# Altium schematic sheet 40. CSI2 CAMERA CONNECTOR.SchDoc: CSI2 EXPANSION CONNECTOR
size 513 x 386 mm; Project: PROC154E2(001)_SK_AM69; Issue: 1.0; RevCode: E3; Page Create Date: March  8, 1995; Variant Name: Core Design; Schematic Page Number: 40; Page Number: 40; Page Size: C; Comment: MISTRAL_TITLEBLK_CSIZE_1; Page Count: 62; Schematic Page Count: 62; Name: PROC154E2 001 SK AM69; DsnPath: C:\Users\danie\Downloads\sprr466c\PROC154E3_RP\PROC154E3_SCH.DSN; SchematicName: SCHEMATIC1; PageName: 40. CSI2 CAMERA CONNECTOR; PageSize: C; TopSchematic: True
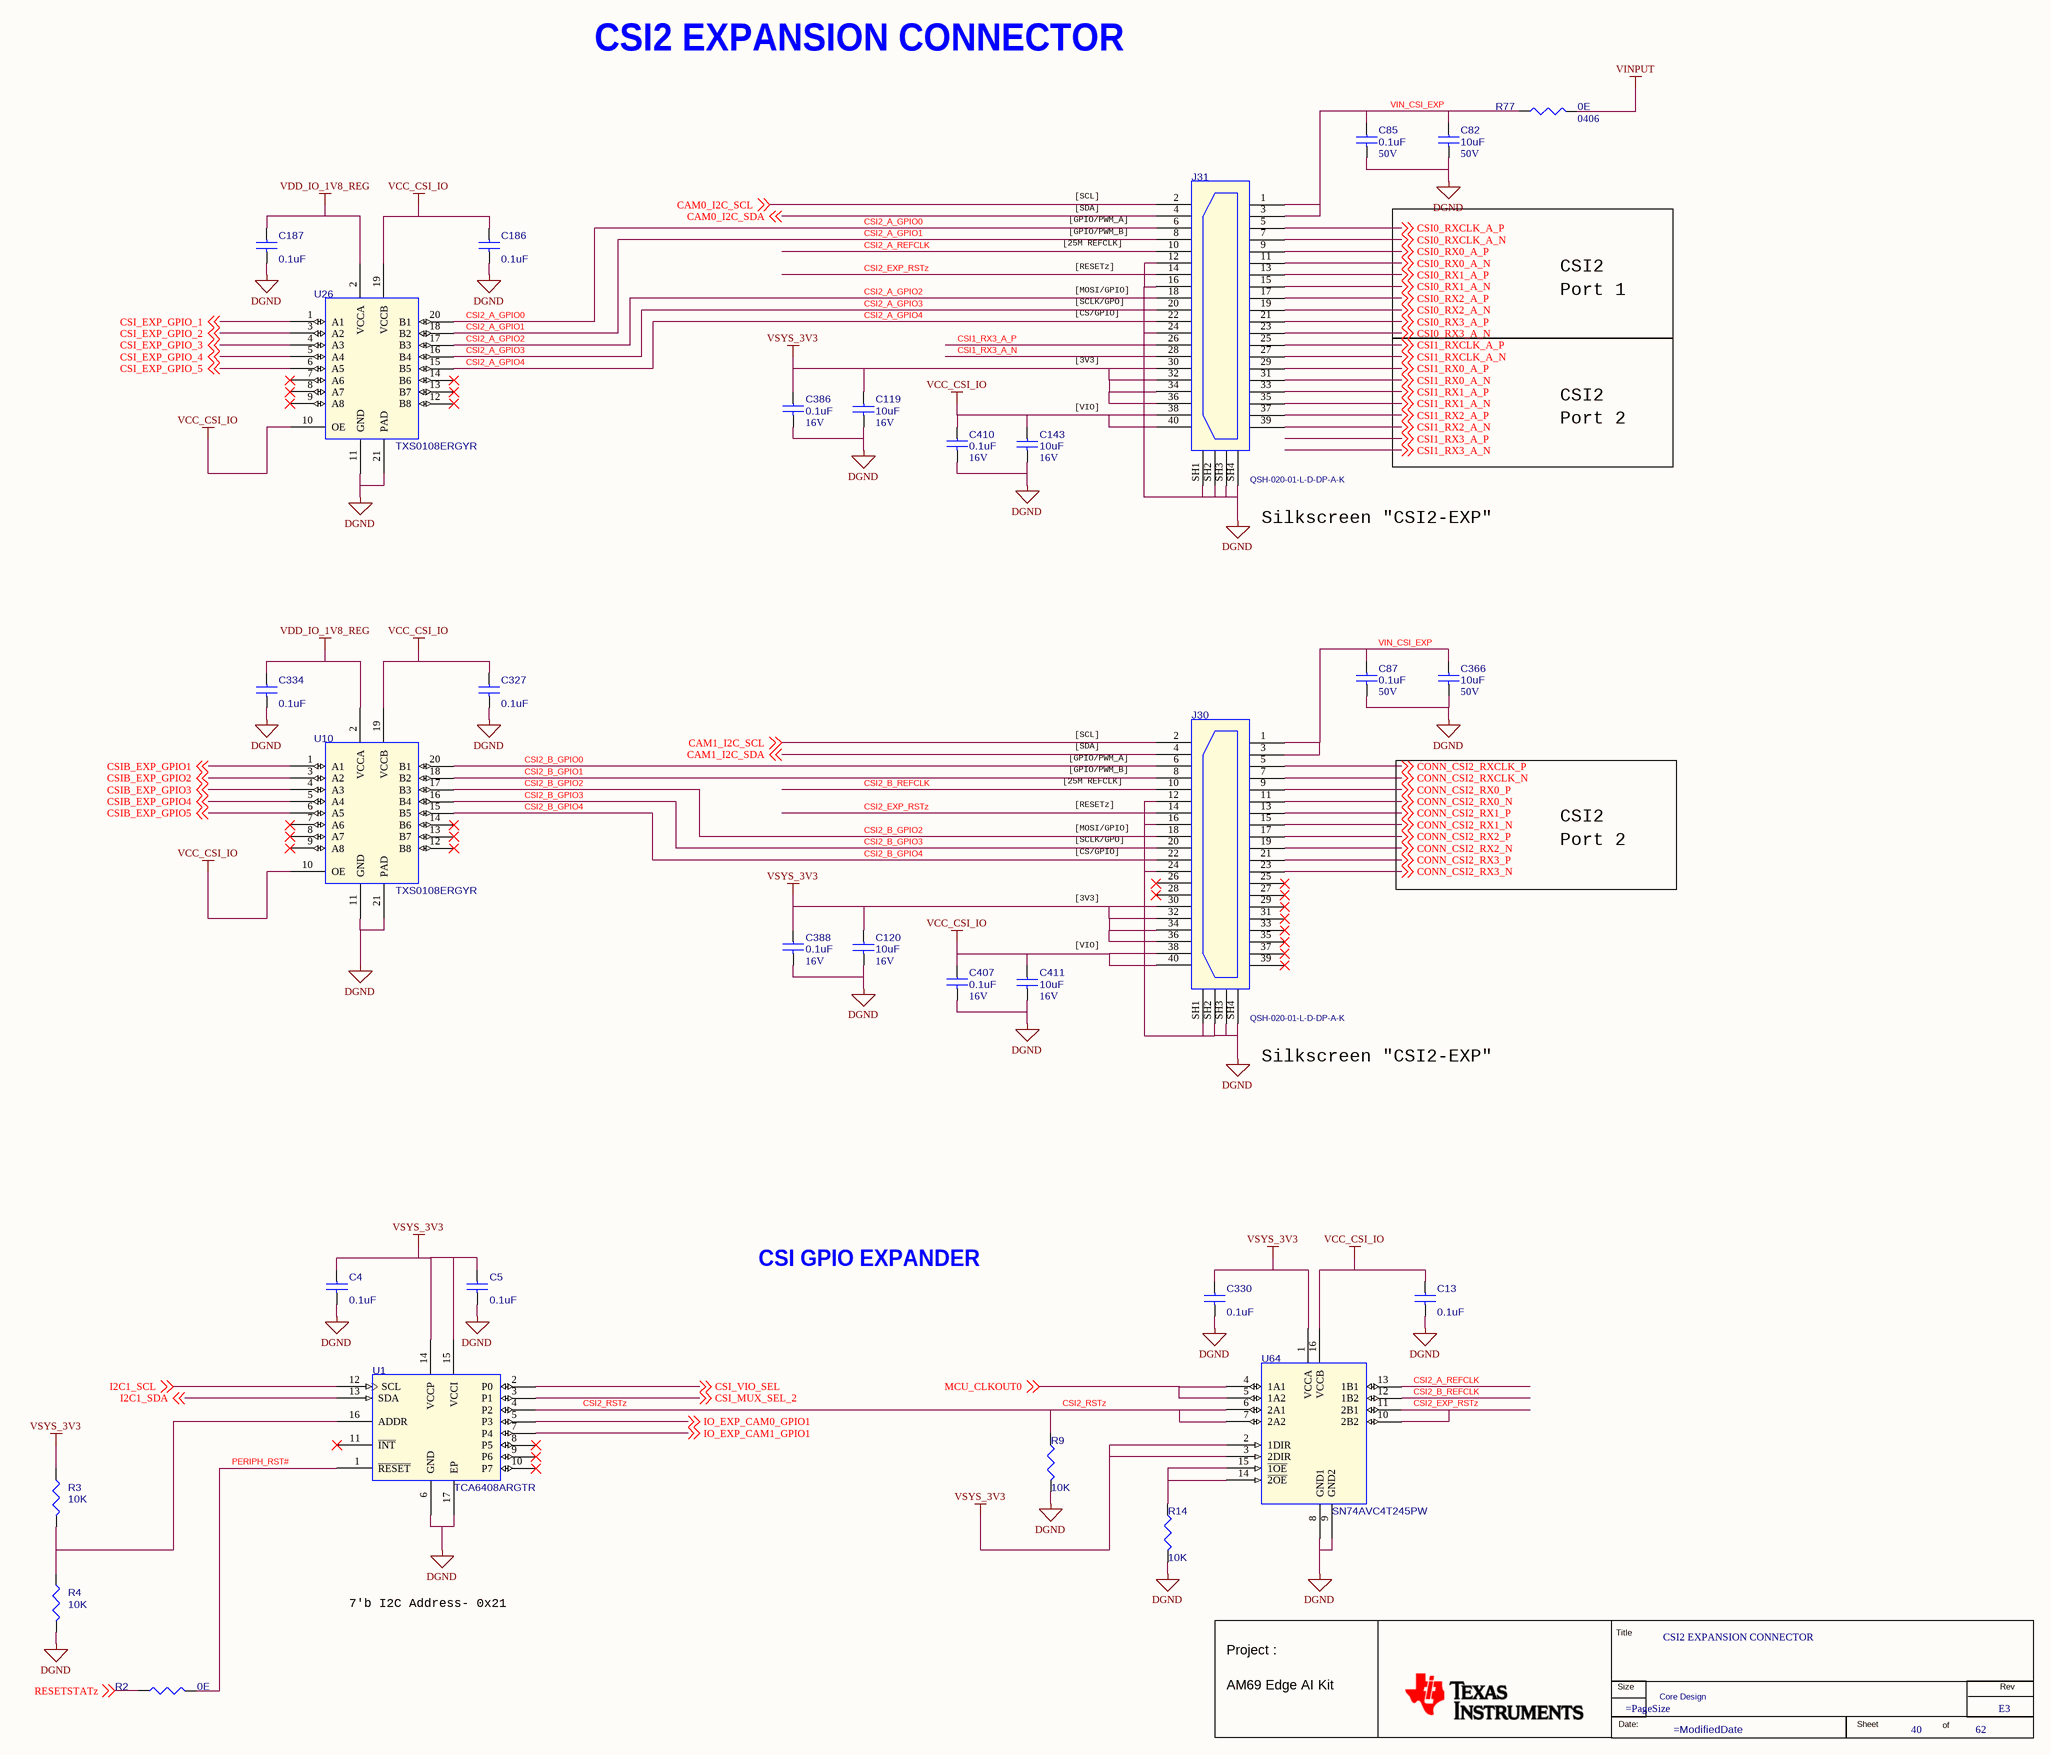
[diagram p0: 40. CSI2 CAMERA CONNECTOR.SchDoc]

## Parts
*  RevCode: E3  Title: CSI2 EXPANSION CONNECTOR  Page Number: 40  Page Count: 62  Variant Name: Core Design  (hidden comment: MISTRAL_TITLEBLK_CSIZE_1)  (graphical)
C4  0.1uF  [CAP0201_0-5]
C5  0.1uF  [CAP0201_0-5]
C13  0.1uF  [CAP0201_0-5]
C82  10uF  Voltage: 50V  [CAP1206_2]
C85  0.1uF  Voltage: 50V  [CAP0402_0-75]
C87  0.1uF  Voltage: 50V  [CAP0402_0-75]
C119  10uF  Voltage: 16V  [CAP0603_1]
C120  10uF  Voltage: 16V  [CAP0603_1]
C143  10uF  Voltage: 16V  [CAP0603_1]
C186  0.1uF  [CAP0201_0-5]
C187  0.1uF  [CAP0201_0-5]
C327  0.1uF  [CAP0201_0-5]
C330  0.1uF  [CAP0201_0-5]
C334  0.1uF  [CAP0201_0-5]
C366  10uF  Voltage: 50V  [CAP1206_2]
C386  0.1uF  Voltage: 16V  [CAP0402_0-75]
C388  0.1uF  Voltage: 16V  [CAP0402_0-75]
C407  0.1uF  Voltage: 16V  [CAP0402_0-75]
C410  0.1uF  Voltage: 16V  [CAP0402_0-75]
C411  10uF  Voltage: 16V  [CAP0603_1]
J30  Mfr_part_number: QSH-020-01-L-D-DP-A-K  [CON_PMC2X20_QSH-020-01-D-DP-A_S_S_S_3-4]  (hidden comment: CON_PMC_2X20_F)
J31  Mfr_part_number: QSH-020-01-L-D-DP-A-K  [CON_PMC2X20_QSH-020-01-D-DP-A_S_S_S_3-4]  (hidden comment: CON_PMC_2X20_F)
R2  0E  [RES0201_0-5]
R3  10K  [RES0201_0-5]
R4  10K  [RES0201_0-5]
R9  10K  [RES0201_0-5]
R14  10K  [RES0201_0-5]
R77  0E  Package: 0406  [RES0406_0-5]
U1  TCA6408ARGTR  [QFN16_19-68_120X120_1_EP1-6]
U10  TXS0108ERGYR  [QFN20_19-68_185X145_1]
U26  TXS0108ERGYR  [QFN20_19-68_185X145_1]
U64  SN74AVC4T245PW  [TSSOP16_25-59_205X180]

## Nets
DGND: C4.2 C5.2 C13.2 C82.2 C85.2 C87.2 C119.2 C120.2 C143.2 C186.2 C187.2 C327.2 C330.2 C334.2 C366.2 C386.2 C388.2 C407.2 C410.2 C411.2 J30.12 J30.16 J30.24 J30.SH1 J30.SH2 J30.SH3 J30.SH4 J31.12 J31.16 J31.24 J31.SH1 J31.SH2 J31.SH3 J31.SH4 R4.1 R9.2 R14.2 U1.6(GND) U1.17(EP) U10.11(GND) U10.21(PAD) U26.11(GND) U26.21(PAD) U64.8(GND1) U64.9(GND2)
VCC_CSI_IO: C13.1 C143.1 C186.1 C327.1 C407.1 C410.1 C411.1 J30.38 J30.40 J31.38 J31.40 U10.10(OE) U10.19(VCCB) U26.10(OE) U26.19(VCCB) U64.16(VCCB)
VDD_IO_1V8_REG: C187.1 C334.1 U10.2(VCCA) U26.2(VCCA)
VINPUT: R77.2
VSYS_3V3: C4.1 C5.1 C119.1 C120.1 C330.1 C386.1 C388.1 J30.30 J30.32 J30.34 J30.36 J31.30 J31.32 J31.34 J31.36 R3.2 U1.14(VCCP) U1.15(VCCI) U64.1(VCCA) U64.2(1DIR) U64.3(2DIR)
CAM0_I2C_SCL: J31.2 ; off-sheet CAM0_I2C_SCL
CAM0_I2C_SDA: J31.4 ; off-sheet CAM0_I2C_SDA
CAM1_I2C_SCL: J30.2 ; off-sheet CAM1_I2C_SCL
CAM1_I2C_SDA: J30.4 ; off-sheet CAM1_I2C_SDA
CONN_CSI2_RX0_N: J30.11 ; off-sheet CONN_CSI2_RX0_N
CONN_CSI2_RX0_P: J30.9 ; off-sheet CONN_CSI2_RX0_P
CONN_CSI2_RX1_N: J30.15 ; off-sheet CONN_CSI2_RX1_N
CONN_CSI2_RX1_P: J30.13 ; off-sheet CONN_CSI2_RX1_P
CONN_CSI2_RX2_N: J30.19 ; off-sheet CONN_CSI2_RX2_N
CONN_CSI2_RX2_P: J30.17 ; off-sheet CONN_CSI2_RX2_P
CONN_CSI2_RX3_N: J30.23 ; off-sheet CONN_CSI2_RX3_N
CONN_CSI2_RX3_P: J30.21 ; off-sheet CONN_CSI2_RX3_P
CONN_CSI2_RXCLK_N: J30.7 ; off-sheet CONN_CSI2_RXCLK_N
CONN_CSI2_RXCLK_P: J30.5 ; off-sheet CONN_CSI2_RXCLK_P
CSI0_RX0_A_N: J31.11 ; off-sheet CSI0_RX0_A_N
CSI0_RX0_A_P: J31.9 ; off-sheet CSI0_RX0_A_P
CSI0_RX1_A_N: J31.15 ; off-sheet CSI0_RX1_A_N
CSI0_RX1_A_P: J31.13 ; off-sheet CSI0_RX1_A_P
CSI0_RX2_A_N: J31.19 ; off-sheet CSI0_RX2_A_N
CSI0_RX2_A_P: J31.17 ; off-sheet CSI0_RX2_A_P
CSI0_RX3_A_N: J31.23 ; off-sheet CSI0_RX3_A_N
CSI0_RX3_A_P: J31.21 ; off-sheet CSI0_RX3_A_P
CSI0_RXCLK_A_N: J31.7 ; off-sheet CSI0_RXCLK_A_N
CSI0_RXCLK_A_P: J31.5 ; off-sheet CSI0_RXCLK_A_P
CSI1_RX0_A_N: J31.31 ; off-sheet CSI1_RX0_A_N
CSI1_RX0_A_P: J31.29 ; off-sheet CSI1_RX0_A_P
CSI1_RX1_A_N: J31.35 ; off-sheet CSI1_RX1_A_N
CSI1_RX1_A_P: J31.33 ; off-sheet CSI1_RX1_A_P
CSI1_RX2_A_N: J31.39 ; off-sheet CSI1_RX2_A_N
CSI1_RX2_A_P: J31.37 ; off-sheet CSI1_RX2_A_P
CSI1_RX3_A_N: J31.28 ; off-sheet CSI1_RX3_A_N
CSI1_RX3_A_P: J31.26 ; off-sheet CSI1_RX3_A_P
CSI1_RXCLK_A_N: J31.27 ; off-sheet CSI1_RXCLK_A_N
CSI1_RXCLK_A_P: J31.25 ; off-sheet CSI1_RXCLK_A_P
CSI2_A_GPIO0: J31.6 U26.20(B1)
CSI2_A_GPIO1: J31.8 U26.18(B2)
CSI2_A_GPIO2: J31.18 U26.17(B3)
CSI2_A_GPIO3: J31.20 U26.16(B4)
CSI2_A_GPIO4: J31.22 U26.15(B5)
CSI2_A_REFCLK: J31.10 U64.13(1B1)
CSI2_B_GPIO0: J30.6 U10.20(B1)
CSI2_B_GPIO1: J30.8 U10.18(B2)
CSI2_B_GPIO2: J30.18 U10.17(B3)
CSI2_B_GPIO3: J30.20 U10.16(B4)
CSI2_B_GPIO4: J30.22 U10.15(B5)
CSI2_B_REFCLK: J30.10 U64.12(1B2)
CSI2_EXP_RSTz: J30.14 J31.14 U64.10(2B2) U64.11(2B1)
CSI2_RSTz: R9.1 U1.4(P2) U64.6(2A1) U64.7(2A2)
CSI_EXP_GPIO_1: U26.1(A1) ; off-sheet CSI_EXP_GPIO_1
CSI_EXP_GPIO_2: U26.3(A2) ; off-sheet CSI_EXP_GPIO_2
CSI_EXP_GPIO_3: U26.4(A3) ; off-sheet CSI_EXP_GPIO_3
CSI_EXP_GPIO_4: U26.5(A4) ; off-sheet CSI_EXP_GPIO_4
CSI_EXP_GPIO_5: U26.6(A5) ; off-sheet CSI_EXP_GPIO_5
CSI_MUX_SEL_2: U1.3(P1) ; off-sheet CSI_MUX_SEL_2
CSI_VIO_SEL: U1.2(P0) ; off-sheet CSI_VIO_SEL
CSIB_EXP_GPIO1: U10.1(A1) ; off-sheet CSIB_EXP_GPIO1
CSIB_EXP_GPIO2: U10.3(A2) ; off-sheet CSIB_EXP_GPIO2
CSIB_EXP_GPIO3: U10.4(A3) ; off-sheet CSIB_EXP_GPIO3
CSIB_EXP_GPIO4: U10.5(A4) ; off-sheet CSIB_EXP_GPIO4
CSIB_EXP_GPIO5: U10.6(A5) ; off-sheet CSIB_EXP_GPIO5
I2C1_SCL: U1.12(SCL) ; off-sheet I2C1_SCL
I2C1_SDA: U1.13(SDA) ; off-sheet I2C1_SDA
IO_EXP_CAM0_GPIO1: U1.5(P3) ; off-sheet IO_EXP_CAM0_GPIO1
IO_EXP_CAM1_GPIO1: U1.7(P4) ; off-sheet IO_EXP_CAM1_GPIO1
MCU_CLKOUT0: U64.4(1A1) U64.5(1A2) ; off-sheet MCU_CLKOUT0
PERIPH_RST#: R2.2 U1.1(~{RESET})
RESETSTATz: R2.1 ; off-sheet RESETSTATz
VIN_CSI_EXP: C82.1 C85.1 C87.1 C366.1 J30.1 J30.3 J31.1 J31.3 R77.1
NetR3_1: R3.1 R4.2 U1.16(ADDR)
NetR14_1: R14.1 U64.14(~{2OE}) U64.15(~{1OE})

Not connected (* = marked no-connect by the designer): J30 25* 26* 27* 28* 29* 31* 33* 35* 37* 39*; U1 8(P5)* 9(P6)* 10(P7)* 11(~{INT})*; U10 7(A6)* 8(A7)* 9(A8)* 12(B8)* 13(B7)* 14(B6)*; U26 7(A6)* 8(A7)* 9(A8)* 12(B8)* 13(B7)* 14(B6)*

## Notes on the sheet
- CSI2 EXPANSION CONNECTOR
- [25M REFCLK]
- [GPIO/PWM_A]
- [GPIO/PWM_B]
- [SDA]
- [SCL]
- [RESETz]
- [MOSI/GPIO]
- [SCLK/GPO]
- CSI2
- Port 1
- [3V3]
- [CS/GPIO]
- [VIO]
- Port 2
- Silkscreen "CSI2-EXP"
- CSI GPIO EXPANDER
- 7'b I2C Address- 0x21
- (in symbol MISTRAL_TITLEBLK_CSIZE_1) Title; Project :; Size; Rev; AM69 Edge AI Kit; Date:; Sheet; of

## Library data of the parts
* = MISTRAL_TITLEBLK_CSIZE_1: Issue: 1.0; Project: PROC154E2(001)_SK_AM69; Name: PROC154E2 001 SK AM69; Page Create Date: March  8, 1995; Page Size: =PageSize; Page Modify Date: =ModifiedDate; Schematic Page Count: 62; Schematic Page Number: 40
C4 = CAP_Dup1: CAP CERAMIC 0.1uF 16V 10% X7S AUTO 0201; Part Reference: C4; Mistral Part No: 120021030007-R; Mfr_name: MURATA; Mfr_part_number: GRT033C71C104KE01D; Part_type: CAPACITORS\CERAMIC; Project: J7ES_SK_BRD; Wattage: NA; Customs_HS_Code: 85322990; Custom_Duty: 15%; Value: 0.1uF; Tolerance: 10%; Voltage: 16V; Package: 0201; Distributor_name: DIGIKEY; Distributor_part_number: 490-GRT033C71C104KE01DTR-ND; Height: 0.33MM; Weight: 330mg; Temperature: -55°C+125°C; Datasheet: Y:\MIS_DATABASE\DATASHEETS\CAPACITORS\GRT033C71C104KE01.PDF; Crtd /date: ALVY/110321; Chkd/date: MANIRAJA/110321; MECHANICAL 3D STEP FILE: CAP0201_0-5; PCB Footprint: CAP0201_0-5
C5 = CAP_Dup1: CAP CERAMIC 0.1uF 16V 10% X7S AUTO 0201; Part Reference: C5; Mistral Part No: 120021030007-R; Mfr_name: MURATA; Mfr_part_number: GRT033C71C104KE01D; Part_type: CAPACITORS\CERAMIC; Project: J7ES_SK_BRD; Wattage: NA; Customs_HS_Code: 85322990; Custom_Duty: 15%; Value: 0.1uF; Tolerance: 10%; Voltage: 16V; Package: 0201; Distributor_name: DIGIKEY; Distributor_part_number: 490-GRT033C71C104KE01DTR-ND; Height: 0.33MM; Weight: 330mg; Temperature: -55°C+125°C; Datasheet: Y:\MIS_DATABASE\DATASHEETS\CAPACITORS\GRT033C71C104KE01.PDF; Crtd /date: ALVY/110321; Chkd/date: MANIRAJA/110321; MECHANICAL 3D STEP FILE: CAP0201_0-5; PCB Footprint: CAP0201_0-5
C13 = CAP_Dup1: CAP CERAMIC 0.1uF 16V 10% X7S AUTO 0201; Part Reference: C13; Mistral Part No: 120021030007-R; Mfr_name: MURATA; Mfr_part_number: GRT033C71C104KE01D; Part_type: CAPACITORS\CERAMIC; Project: J7ES_SK_BRD; Wattage: NA; Customs_HS_Code: 85322990; Custom_Duty: 15%; Value: 0.1uF; Tolerance: 10%; Voltage: 16V; Package: 0201; Distributor_name: DIGIKEY; Distributor_part_number: 490-GRT033C71C104KE01DTR-ND; Height: 0.33MM; Weight: 330mg; Temperature: -55°C+125°C; Datasheet: Y:\MIS_DATABASE\DATASHEETS\CAPACITORS\GRT033C71C104KE01.PDF; Crtd /date: ALVY/110321; Chkd/date: MANIRAJA/110321; MECHANICAL 3D STEP FILE: CAP0201_0-5; PCB Footprint: CAP0201_0-5
C82 = CAP_Dup1: CAP CERAMIC 10uF 50V 10% X5R AUTO 1206; Part Reference: C82; Mistral Part No: 120011060019-R; Mfr_name: MURATA; Mfr_part_number: GRT31CR61H106KE01L; Part_type: CAPACITORS\CERAMIC; Direct Alternate_mfr_name: SAMSUNG; Direct Alternate_mfr_part_number: CL31A106KBHNNNE; Automotive Alternate_mfr_name: TDK; Automotive Alternate_mfr_part_number: CGA5L1X7R1H106K160AC; Project: LRDE_ABCMV2_MB; Wattage: NA; Customs_HS_Code: 85322990; Custom_Duty: 15%; Value: 10uF; Footprint Path: Y:\MIS_DATABASE\Library\ALTIUM_TOOL\PCB_FOOTPRINTS\Altium_Footprint_Lib.PcbLib; Library Path: Y:\MIS_DATABASE\Library\ALTIUM_TOOL\SCHEMATICS_PARTS\MS_DISCRETE_Library.schlib; Footprint Ref: CAP1206_2; MECHANICAL 3D STEP FILE: CAP1206_2; Tolerance: 10%; Package: 1206; Distributor_name: DIGIKEY; Distributor_part_number: 490-12456-1-ND; Library Ref: CAP; Height: 1.80MM; Weight: 16.2mg; Temperature: -55°C+85°C; Datasheet: Y:\MIS_DATABASE\DATASHEETS\CAPACITORS\GRT31CR61H106KE01L.PDF; Crtd /date: ALVY/261018; Chkd/date: MANIRAJA/261018; PCB Footprint: CAP1206_2
C85 = CAP_Dup1: CAP CERAMIC 0.1uF 50V 10% X7R AUTO 0402; Part Reference: C85; Part_type: CAPACITORS\CERAMIC; Mfr_part_number: GRT155R71H104KE01D; Mfr_name: MURATA; Mistral Part No: 120019030005-R; Custom_Duty: 15%; Customs_HS_Code: 85322990; Wattage: NA; Project: TI_DRA821 SK EVM BRD; Value: 0.1uF; Footprint Path: Y:\MIS_DATABASE\Library\ALTIUM_TOOL\PCB_FOOTPRINTS\Altium_Footprint_Lib.PcbLib; Library Path: Y:\MIS_DATABASE\Library\ALTIUM_TOOL\SCHEMATICS_PARTS\MS_DISCRETE_Library.schlib; Footprint Ref: CAP0402_0-75; Chkd/date: MANIRAJA/250221; Crtd /date: ALVY/240221; Datasheet: Y:\MIS_DATABASE\DATASHEETS\CAPACITORS\GRT155R71H104KE01.PDF; Temperature: -55°C+125°C; Weight: NA; Height: 0.55MM; Library Ref: CAP; Distributor_part_number: 81-GRT155R71H104KE1D; Distributor_name: MOUSER; Package: 0402; Tolerance: 10%; MECHANICAL 3D STEP FILE: CAP0402_0-75; PCB Footprint: CAP0402_0-75
C87 = CAP_Dup1: CAP CERAMIC 0.1uF 50V 10% X7R AUTO 0402; Part Reference: C87; Mistral Part No: 120019030005-R; Mfr_name: MURATA; Mfr_part_number: GRT155R71H104KE01D; Part_type: CAPACITORS\CERAMIC; Project: TI_DRA821 SK EVM BRD; Wattage: NA; Customs_HS_Code: 85322990; Custom_Duty: 15%; Value: 0.1uF; MECHANICAL 3D STEP FILE: CAP0402_0-75; Tolerance: 10%; Package: 0402; Distributor_name: MOUSER; Distributor_part_number: 81-GRT155R71H104KE1D; Library Ref: CAP; Height: 0.55MM; Weight: NA; Temperature: -55°C+125°C; Datasheet: Y:\MIS_DATABASE\DATASHEETS\CAPACITORS\GRT155R71H104KE01.PDF; Crtd /date: ALVY/240221; Chkd/date: MANIRAJA/250221; Footprint Ref: CAP0402_0-75; Library Path: Y:\MIS_DATABASE\Library\ALTIUM_TOOL\SCHEMATICS_PARTS\MS_DISCRETE_Library.schlib; Footprint Path: Y:\MIS_DATABASE\Library\ALTIUM_TOOL\PCB_FOOTPRINTS\Altium_Footprint_Lib.PcbLib; PCB Footprint: CAP0402_0-75
C119 = CAP_Dup1: CAP CERAMIC 10uF 16V 20% X6S AUTO 0603; Part Reference: C119; Part_type: CAPACITORS\CERAMIC; Mfr_part_number: GRT188C81C106ME13D; Mfr_name: MURATA; Mistral Part No: 120020090012-R; Direct Alternate_mfr_name: TDK; Direct Alternate_mfr_part_number: C1608X5R1E106M080AC; Automotive Alternate_mfr_part_number: GRT188R61E106ME13D; Custom_Duty: 15%; Customs_HS_Code: 85322990; Wattage: NA; Project: J7VCL_SOM_LEO_HERA_PMIC_BRD; Value: 10uF; Footprint Path: Y:\MIS_DATABASE\Library\ALTIUM_TOOL\PCB_FOOTPRINTS\Altium_Footprint_Lib.PcbLib; Library Path: Y:\MIS_DATABASE\Library\ALTIUM_TOOL\SCHEMATICS_PARTS\MS_DISCRETE_Library.schlib; Footprint Ref: CAP0603_1; Library Ref: CAP; MECHANICAL 3D STEP FILE: CAP0603_1; Chkd/date: MANIRAJA/180920; Crtd /date: ALVY/170920; Datasheet: Y:\MIS_DATABASE\DATASHEETS\CAPACITORS\GRT188C81C106ME13.PDF; Temperature: -55°C+105°C; Weight: 2mg; Height: 1.00MM; Distributor_part_number: 490-12286-1-ND; Distributor_name: DIGIKEY; Package: 0603; Tolerance: 20%; Automotive Alternate_mfr_name: MURATA; PCB Footprint: CAP0603_1
C120 = CAP_Dup1: CAP CERAMIC 10uF 16V 20% X6S AUTO 0603; Part Reference: C120; Automotive Alternate_mfr_part_number: GRT188R61E106ME13D; Automotive Alternate_mfr_name: MURATA; Direct Alternate_mfr_part_number: C1608X5R1E106M080AC; Direct Alternate_mfr_name: TDK; Mistral Part No: 120020090012-R; Mfr_part_number: GRT188C81C106ME13D; Part_type: CAPACITORS\CERAMIC; Project: J7VCL_SOM_LEO_HERA_PMIC_BRD; Wattage: NA; Customs_HS_Code: 85322990; Custom_Duty: 15%; Value: 10uF; Mfr_name: MURATA; Tolerance: 20%; Package: 0603; Distributor_name: DIGIKEY; Distributor_part_number: 490-12286-1-ND; Height: 1.00MM; Weight: 2mg; Temperature: -55°C+105°C; Datasheet: Y:\MIS_DATABASE\DATASHEETS\CAPACITORS\GRT188C81C106ME13.PDF; Crtd /date: ALVY/170920; Chkd/date: MANIRAJA/180920; MECHANICAL 3D STEP FILE: CAP0603_1; Library Ref: CAP; Footprint Ref: CAP0603_1; Library Path: Y:\MIS_DATABASE\Library\ALTIUM_TOOL\SCHEMATICS_PARTS\MS_DISCRETE_Library.schlib; Footprint Path: Y:\MIS_DATABASE\Library\ALTIUM_TOOL\PCB_FOOTPRINTS\Altium_Footprint_Lib.PcbLib; PCB Footprint: CAP0603_1
C143 = CAP_Dup1: CAP CERAMIC 10uF 16V 20% X6S AUTO 0603; Part Reference: C143; Part_type: CAPACITORS\CERAMIC; Mfr_part_number: GRT188C81C106ME13D; Mfr_name: MURATA; Mistral Part No: 120020090012-R; Direct Alternate_mfr_name: TDK; Direct Alternate_mfr_part_number: C1608X5R1E106M080AC; Automotive Alternate_mfr_part_number: GRT188R61E106ME13D; Custom_Duty: 15%; Customs_HS_Code: 85322990; Wattage: NA; Project: J7VCL_SOM_LEO_HERA_PMIC_BRD; Value: 10uF; Library Ref: CAP; MECHANICAL 3D STEP FILE: CAP0603_1; Chkd/date: MANIRAJA/180920; Crtd /date: ALVY/170920; Datasheet: Y:\MIS_DATABASE\DATASHEETS\CAPACITORS\GRT188C81C106ME13.PDF; Temperature: -55°C+105°C; Weight: 2mg; Height: 1.00MM; Distributor_part_number: 490-12286-1-ND; Distributor_name: DIGIKEY; Package: 0603; Tolerance: 20%; Footprint Ref: CAP0603_1; Library Path: Y:\MIS_DATABASE\Library\ALTIUM_TOOL\SCHEMATICS_PARTS\MS_DISCRETE_Library.schlib; Footprint Path: Y:\MIS_DATABASE\Library\ALTIUM_TOOL\PCB_FOOTPRINTS\Altium_Footprint_Lib.PcbLib; Automotive Alternate_mfr_name: MURATA; PCB Footprint: CAP0603_1
C186 = CAP_Dup1: CAP CERAMIC 0.1uF 16V 10% X7S AUTO 0201; Part Reference: C186; Part_type: CAPACITORS\CERAMIC; Mfr_part_number: GRT033C71C104KE01D; Mfr_name: MURATA; Mistral Part No: 120021030007-R; Custom_Duty: 15%; Customs_HS_Code: 85322990; Wattage: NA; Project: J7ES_SK_BRD; Value: 0.1uF; MECHANICAL 3D STEP FILE: CAP0201_0-5; Chkd/date: MANIRAJA/110321; Crtd /date: ALVY/110321; Datasheet: Y:\MIS_DATABASE\DATASHEETS\CAPACITORS\GRT033C71C104KE01.PDF; Temperature: -55°C+125°C; Weight: 330mg; Height: 0.33MM; Distributor_part_number: 490-GRT033C71C104KE01DTR-ND; Distributor_name: DIGIKEY; Package: 0201; Voltage: 16V; Tolerance: 10%; PCB Footprint: CAP0201_0-5
C187 = CAP_Dup1: CAP CERAMIC 0.1uF 16V 10% X7S AUTO 0201; Part Reference: C187; Part_type: CAPACITORS\CERAMIC; Mfr_part_number: GRT033C71C104KE01D; Mfr_name: MURATA; Mistral Part No: 120021030007-R; Custom_Duty: 15%; Customs_HS_Code: 85322990; Wattage: NA; Project: J7ES_SK_BRD; Value: 0.1uF; MECHANICAL 3D STEP FILE: CAP0201_0-5; Chkd/date: MANIRAJA/110321; Crtd /date: ALVY/110321; Datasheet: Y:\MIS_DATABASE\DATASHEETS\CAPACITORS\GRT033C71C104KE01.PDF; Temperature: -55°C+125°C; Weight: 330mg; Height: 0.33MM; Distributor_part_number: 490-GRT033C71C104KE01DTR-ND; Distributor_name: DIGIKEY; Package: 0201; Voltage: 16V; Tolerance: 10%; PCB Footprint: CAP0201_0-5
C327 = CAP_Dup1: CAP CERAMIC 0.1uF 16V 10% X7S AUTO 0201; Part Reference: C327; Mistral Part No: 120021030007-R; Mfr_name: MURATA; Mfr_part_number: GRT033C71C104KE01D; Part_type: CAPACITORS\CERAMIC; Project: J7ES_SK_BRD; Wattage: NA; Customs_HS_Code: 85322990; Custom_Duty: 15%; Value: 0.1uF; Tolerance: 10%; Voltage: 16V; Package: 0201; Distributor_name: DIGIKEY; Distributor_part_number: 490-GRT033C71C104KE01DTR-ND; Height: 0.33MM; Weight: 330mg; Temperature: -55°C+125°C; Datasheet: Y:\MIS_DATABASE\DATASHEETS\CAPACITORS\GRT033C71C104KE01.PDF; Crtd /date: ALVY/110321; Chkd/date: MANIRAJA/110321; MECHANICAL 3D STEP FILE: CAP0201_0-5; PCB Footprint: CAP0201_0-5
C330 = CAP_Dup1: CAP CERAMIC 0.1uF 16V 10% X7S AUTO 0201; Part Reference: C330; Part_type: CAPACITORS\CERAMIC; Mfr_part_number: GRT033C71C104KE01D; Mfr_name: MURATA; Mistral Part No: 120021030007-R; Custom_Duty: 15%; Customs_HS_Code: 85322990; Wattage: NA; Project: J7ES_SK_BRD; Value: 0.1uF; MECHANICAL 3D STEP FILE: CAP0201_0-5; Chkd/date: MANIRAJA/110321; Crtd /date: ALVY/110321; Datasheet: Y:\MIS_DATABASE\DATASHEETS\CAPACITORS\GRT033C71C104KE01.PDF; Temperature: -55°C+125°C; Weight: 330mg; Height: 0.33MM; Distributor_part_number: 490-GRT033C71C104KE01DTR-ND; Distributor_name: DIGIKEY; Package: 0201; Voltage: 16V; Tolerance: 10%; PCB Footprint: CAP0201_0-5
C334 = CAP_Dup1: CAP CERAMIC 0.1uF 16V 10% X7S AUTO 0201; Part Reference: C334; Mistral Part No: 120021030007-R; Mfr_name: MURATA; Mfr_part_number: GRT033C71C104KE01D; Part_type: CAPACITORS\CERAMIC; Project: J7ES_SK_BRD; Wattage: NA; Customs_HS_Code: 85322990; Custom_Duty: 15%; Value: 0.1uF; Tolerance: 10%; Voltage: 16V; Package: 0201; Distributor_name: DIGIKEY; Distributor_part_number: 490-GRT033C71C104KE01DTR-ND; Height: 0.33MM; Weight: 330mg; Temperature: -55°C+125°C; Datasheet: Y:\MIS_DATABASE\DATASHEETS\CAPACITORS\GRT033C71C104KE01.PDF; Crtd /date: ALVY/110321; Chkd/date: MANIRAJA/110321; MECHANICAL 3D STEP FILE: CAP0201_0-5; PCB Footprint: CAP0201_0-5
C366 = CAP_Dup1: CAP CERAMIC 10uF 50V 10% X5R AUTO 1206; Part Reference: C366; Automotive Alternate_mfr_part_number: CGA5L1X7R1H106K160AC; Automotive Alternate_mfr_name: TDK; Direct Alternate_mfr_part_number: CL31A106KBHNNNE; Direct Alternate_mfr_name: SAMSUNG; Part_type: CAPACITORS\CERAMIC; Mfr_part_number: GRT31CR61H106KE01L; Mfr_name: MURATA; Mistral Part No: 120011060019-R; Custom_Duty: 15%; Customs_HS_Code: 85322990; Wattage: NA; Project: LRDE_ABCMV2_MB; Value: 10uF; Chkd/date: MANIRAJA/261018; Crtd /date: ALVY/261018; Datasheet: Y:\MIS_DATABASE\DATASHEETS\CAPACITORS\GRT31CR61H106KE01L.PDF; Temperature: -55°C+85°C; Weight: 16.2mg; Height: 1.80MM; Library Ref: CAP; Distributor_part_number: 490-12456-1-ND; Distributor_name: DIGIKEY; Package: 1206; Tolerance: 10%; MECHANICAL 3D STEP FILE: CAP1206_2; Footprint Ref: CAP1206_2; Library Path: Y:\MIS_DATABASE\Library\ALTIUM_TOOL\SCHEMATICS_PARTS\MS_DISCRETE_Library.schlib; Footprint Path: Y:\MIS_DATABASE\Library\ALTIUM_TOOL\PCB_FOOTPRINTS\Altium_Footprint_Lib.PcbLib; PCB Footprint: CAP1206_2
C386 = CAP_Dup1: CAP CERAMIC 0.1uF 16V 10% X7R AUTO 0402; Part Reference: C386; Mistral Part No: 120016070006-R; Mfr_name: MURATA; Mfr_part_number: GCM155R71C104KA55D; Part_type: CAPACITORS\CERAMIC; Direct Alternate_mfr_part_number: GCM155R71C104JA55D; Automotive Alternate_mfr_name: TDK; Automotive Alternate_mfr_part_number: CGA2B1X7R1C104K050BC; Project: DCMIST_FPGA_CARD; Wattage: NA; Customs_HS_Code: 85322990; Custom_Duty: 15%; Value: 0.1uF; Library Ref: CAP; Tolerance: 10%; Package: 0402; Distributor_name: DIGIKEY; Distributor_part_number: 490-4759-1-ND; Height: 0.55MM; Weight: 6mg; Temperature: -55°C+125°C; Datasheet: Y:\MIS_DATABASE\DATASHEETS\CAPACITORS\MURATA-GCM-SER.PDF; Crtd /date: VASANTHA/300514; Chkd/date: NAVEED/021014; Footprint Ref: CAP0402_0-75; Library Path: Y:\MIS_DATABASE\Library\ALTIUM_TOOL\SCHEMATICS_PARTS\MS_DISCRETE_Library.schlib; Footprint Path: Y:\MIS_DATABASE\Library\ALTIUM_TOOL\PCB_FOOTPRINTS\Altium_Footprint_Lib.PcbLib; MECHANICAL 3D STEP FILE: CAP0402_0-75; Direct Alternate_mfr_name: MURATA; PCB Footprint: CAP0402_0-75
C388 = CAP_Dup1: CAP CERAMIC 0.1uF 16V 10% X7R AUTO 0402; Part Reference: C388; Automotive Alternate_mfr_part_number: CGA2B1X7R1C104K050BC; Automotive Alternate_mfr_name: TDK; Direct Alternate_mfr_part_number: GCM155R71C104JA55D; Direct Alternate_mfr_name: MURATA; Part_type: CAPACITORS\CERAMIC; Mfr_part_number: GCM155R71C104KA55D; Mistral Part No: 120016070006-R; Custom_Duty: 15%; Customs_HS_Code: 85322990; Wattage: NA; Project: DCMIST_FPGA_CARD; Value: 0.1uF; MECHANICAL 3D STEP FILE: CAP0402_0-75; Footprint Path: Y:\MIS_DATABASE\Library\ALTIUM_TOOL\PCB_FOOTPRINTS\Altium_Footprint_Lib.PcbLib; Library Path: Y:\MIS_DATABASE\Library\ALTIUM_TOOL\SCHEMATICS_PARTS\MS_DISCRETE_Library.schlib; Footprint Ref: CAP0402_0-75; Chkd/date: NAVEED/021014; Crtd /date: VASANTHA/300514; Datasheet: Y:\MIS_DATABASE\DATASHEETS\CAPACITORS\MURATA-GCM-SER.PDF; Temperature: -55°C+125°C; Weight: 6mg; Height: 0.55MM; Distributor_part_number: 490-4759-1-ND; Distributor_name: DIGIKEY; Package: 0402; Tolerance: 10%; Mfr_name: MURATA; Library Ref: CAP; PCB Footprint: CAP0402_0-75
C407 = CAP_Dup1: CAP CERAMIC 0.1uF 16V 10% X7R AUTO 0402; Part Reference: C407; Automotive Alternate_mfr_part_number: CGA2B1X7R1C104K050BC; Automotive Alternate_mfr_name: TDK; Direct Alternate_mfr_part_number: GCM155R71C104JA55D; Direct Alternate_mfr_name: MURATA; Part_type: CAPACITORS\CERAMIC; Mfr_part_number: GCM155R71C104KA55D; Mistral Part No: 120016070006-R; Custom_Duty: 15%; Customs_HS_Code: 85322990; Wattage: NA; Project: DCMIST_FPGA_CARD; Value: 0.1uF; MECHANICAL 3D STEP FILE: CAP0402_0-75; Footprint Path: Y:\MIS_DATABASE\Library\ALTIUM_TOOL\PCB_FOOTPRINTS\Altium_Footprint_Lib.PcbLib; Library Path: Y:\MIS_DATABASE\Library\ALTIUM_TOOL\SCHEMATICS_PARTS\MS_DISCRETE_Library.schlib; Footprint Ref: CAP0402_0-75; Chkd/date: NAVEED/021014; Crtd /date: VASANTHA/300514; Datasheet: Y:\MIS_DATABASE\DATASHEETS\CAPACITORS\MURATA-GCM-SER.PDF; Temperature: -55°C+125°C; Weight: 6mg; Height: 0.55MM; Distributor_part_number: 490-4759-1-ND; Distributor_name: DIGIKEY; Package: 0402; Tolerance: 10%; Mfr_name: MURATA; Library Ref: CAP; PCB Footprint: CAP0402_0-75
C410 = CAP_Dup1: CAP CERAMIC 0.1uF 16V 10% X7R AUTO 0402; Part Reference: C410; Mistral Part No: 120016070006-R; Mfr_name: MURATA; Mfr_part_number: GCM155R71C104KA55D; Part_type: CAPACITORS\CERAMIC; Direct Alternate_mfr_part_number: GCM155R71C104JA55D; Automotive Alternate_mfr_name: TDK; Automotive Alternate_mfr_part_number: CGA2B1X7R1C104K050BC; Project: DCMIST_FPGA_CARD; Wattage: NA; Customs_HS_Code: 85322990; Custom_Duty: 15%; Value: 0.1uF; Library Ref: CAP; Tolerance: 10%; Package: 0402; Distributor_name: DIGIKEY; Distributor_part_number: 490-4759-1-ND; Height: 0.55MM; Weight: 6mg; Temperature: -55°C+125°C; Datasheet: Y:\MIS_DATABASE\DATASHEETS\CAPACITORS\MURATA-GCM-SER.PDF; Crtd /date: VASANTHA/300514; Chkd/date: NAVEED/021014; Footprint Ref: CAP0402_0-75; Library Path: Y:\MIS_DATABASE\Library\ALTIUM_TOOL\SCHEMATICS_PARTS\MS_DISCRETE_Library.schlib; Footprint Path: Y:\MIS_DATABASE\Library\ALTIUM_TOOL\PCB_FOOTPRINTS\Altium_Footprint_Lib.PcbLib; MECHANICAL 3D STEP FILE: CAP0402_0-75; Direct Alternate_mfr_name: MURATA; PCB Footprint: CAP0402_0-75
C411 = CAP_Dup1: CAP CERAMIC 10uF 16V 20% X6S AUTO 0603; Part Reference: C411; Automotive Alternate_mfr_part_number: GRT188R61E106ME13D; Automotive Alternate_mfr_name: MURATA; Direct Alternate_mfr_part_number: C1608X5R1E106M080AC; Direct Alternate_mfr_name: TDK; Mistral Part No: 120020090012-R; Mfr_part_number: GRT188C81C106ME13D; Part_type: CAPACITORS\CERAMIC; Project: J7VCL_SOM_LEO_HERA_PMIC_BRD; Wattage: NA; Customs_HS_Code: 85322990; Custom_Duty: 15%; Value: 10uF; Footprint Path: Y:\MIS_DATABASE\Library\ALTIUM_TOOL\PCB_FOOTPRINTS\Altium_Footprint_Lib.PcbLib; Library Path: Y:\MIS_DATABASE\Library\ALTIUM_TOOL\SCHEMATICS_PARTS\MS_DISCRETE_Library.schlib; Footprint Ref: CAP0603_1; Mfr_name: MURATA; Tolerance: 20%; Package: 0603; Distributor_name: DIGIKEY; Distributor_part_number: 490-12286-1-ND; Height: 1.00MM; Weight: 2mg; Temperature: -55°C+105°C; Datasheet: Y:\MIS_DATABASE\DATASHEETS\CAPACITORS\GRT188C81C106ME13.PDF; Crtd /date: ALVY/170920; Chkd/date: MANIRAJA/180920; MECHANICAL 3D STEP FILE: CAP0603_1; Library Ref: CAP; PCB Footprint: CAP0603_1
J30 = CON_PMC_20X2_F_DP_TI: CON PMC 2X20 0.50MM PITCH FEMALE ST SMD; Part Reference: J30; Mistral Part No: 150018100049-R; Mfr_name: SAMTEC; Part_type: CONNECTOR\PMC; Project: TI_J7ES_EVM_CP; Tolerance: NA; Customs_HS_Code: 85369090; Custom_Duty: 24%; Value: CON_PMC_2X20_F; Footprint Ref: CON_PMC2X20_QSH-020-01-D-DP-A_S_S_S_3-4; Voltage: NA; Wattage: NA; Package: SMD; Distributor_name: DIGIKEY; Distributor_part_number: SAM10648-ND; Library Ref: CON_PMC_20X2_F_DP; Height: 3.33MM; Weight: NA; Temperature: -55°C+125°C; Datasheet: Y:\MIS_DATABASE\DATASHEETS\CONNECTORS\QSH-SERIES.PDF; Crtd /date: ALVY/251018; Chkd/date: MANIRAJA/251018; MECHANICAL 3D STEP FILE: CON_PMC2X20_QSH-020-01-D-DP-A_S_S_S_3-4; Library Path: Y:\MIS_DATABASE\Library\ALTIUM_TOOL\SCHEMATICS_PARTS\MS_CONNECTOR_Library.schlib; Footprint Path: Y:\MIS_DATABASE\Library\ALTIUM_TOOL\PCB_FOOTPRINTS\Altium_Footprint_Lib.PcbLib; PCB Footprint: CON_PMC2X20_QSH-020-01-D-DP-A_S_S_S_3-4
J31 = CON_PMC_20X2_F_DP_TI: CON PMC 2X20 0.50MM PITCH FEMALE ST SMD; Part Reference: J31; Part_type: CONNECTOR\PMC; Mfr_name: SAMTEC; Mistral Part No: 150018100049-R; Custom_Duty: 24%; Customs_HS_Code: 85369090; Wattage: NA; Project: TI_J7ES_EVM_CP; Value: CON_PMC_2X20_F; Footprint Path: Y:\MIS_DATABASE\Library\ALTIUM_TOOL\PCB_FOOTPRINTS\Altium_Footprint_Lib.PcbLib; Library Path: Y:\MIS_DATABASE\Library\ALTIUM_TOOL\SCHEMATICS_PARTS\MS_CONNECTOR_Library.schlib; MECHANICAL 3D STEP FILE: CON_PMC2X20_QSH-020-01-D-DP-A_S_S_S_3-4; Chkd/date: MANIRAJA/251018; Crtd /date: ALVY/251018; Datasheet: Y:\MIS_DATABASE\DATASHEETS\CONNECTORS\QSH-SERIES.PDF; Temperature: -55°C+125°C; Weight: NA; Height: 3.33MM; Library Ref: CON_PMC_20X2_F_DP; Distributor_part_number: SAM10648-ND; Distributor_name: DIGIKEY; Package: SMD; Voltage: NA; Tolerance: NA; Footprint Ref: CON_PMC2X20_QSH-020-01-D-DP-A_S_S_S_3-4; PCB Footprint: CON_PMC2X20_QSH-020-01-D-DP-A_S_S_S_3-4
R2 = RESISTOR_Dup2: RES 0E 1/20W JUMPER 0201; Part Reference: R2; Mistral Part No: 110009030078-R; Mfr_name: PANASONIC-ECG; Mfr_part_number: ERJ-1GN0R00C; Part_type: RESISTORS\FIXED; Project: SRMS-SAR_BRD; Tolerance: NA; Customs_HS_Code: 85332119; Custom_Duty: 15%; Value: 0E; Footprint Ref: RES0201_0-5; Voltage: NA; Wattage: 1/20W; Package: 0201; Distributor_name: DIGIKEY; Distributor_part_number: P15979CT-ND; Library Ref: RESISTOR; Height: 0.26MM; Weight: 0.15mg; Temperature: -55°C+125°C; Datasheet: Y:\MIS_DATABASE\DATASHEETS\RESISTORS\PAN-ERJSER_NOV17.PDF; Crtd /date: ALVY/290421; Chkd/date: MANIRAJA/290421; MECHANICAL 3D STEP FILE: RES0201_0-5; Library Path: Y:\MIS_DATABASE\Library\ALTIUM_TOOL\SCHEMATICS_PARTS\MS_DISCRETE_Library.schlib; Footprint Path: Y:\MIS_DATABASE\Library\ALTIUM_TOOL\PCB_FOOTPRINTS\Altium_Footprint_Lib.PcbLib; PCB Footprint: RES0201_0-5
R3 = RESISTOR_Dup2: RES 10K 1/20W 5% 0201; Part Reference: R3; Part_type: RESISTORS\FIXED; Mfr_part_number: RC0201JR-0710KL; Mfr_name: YAGEO AMERICA; Mistral Part No: 110010070051-R; Custom_Duty: 15%; Customs_HS_Code: 85332119; Voltage: NA; Project: GOLDEN-I LITE; Value: 10K; MECHANICAL 3D STEP FILE: RES0201_0-5; Chkd/date: MANIRAJA/050517; Crtd /date: MANIRAJA/050517; Datasheet: Y:\MIS_DATABASE\DATASHEETS\RESISTORS\RCXXXXL-SER_MAR18.PDF; Temperature: -55°C+125°C; Weight: 0.17mg; Height: 0.26MM; Distributor_part_number: 311-10KNCT-ND; Distributor_name: DIGIKEY; Package: 0201; Wattage: 1/20W; Tolerance: 5%; Library Ref: RESISTOR; Footprint Ref: RES0201_0-5; Library Path: Y:\MIS_DATABASE\Library\ALTIUM_TOOL\SCHEMATICS_PARTS\MS_DISCRETE_Library.schlib; Footprint Path: Y:\MIS_DATABASE\Library\ALTIUM_TOOL\PCB_FOOTPRINTS\Altium_Footprint_Lib.PcbLib; PCB Footprint: RES0201_0-5
R4 = RESISTOR_Dup2: RES 10K 1/20W 5% 0201; Part Reference: R4; Part_type: RESISTORS\FIXED; Mfr_part_number: RC0201JR-0710KL; Mfr_name: YAGEO AMERICA; Mistral Part No: 110010070051-R; Custom_Duty: 15%; Customs_HS_Code: 85332119; Voltage: NA; Project: GOLDEN-I LITE; Value: 10K; MECHANICAL 3D STEP FILE: RES0201_0-5; Chkd/date: MANIRAJA/050517; Crtd /date: MANIRAJA/050517; Datasheet: Y:\MIS_DATABASE\DATASHEETS\RESISTORS\RCXXXXL-SER_MAR18.PDF; Temperature: -55°C+125°C; Weight: 0.17mg; Height: 0.26MM; Distributor_part_number: 311-10KNCT-ND; Distributor_name: DIGIKEY; Package: 0201; Wattage: 1/20W; Tolerance: 5%; Library Ref: RESISTOR; Footprint Ref: RES0201_0-5; Library Path: Y:\MIS_DATABASE\Library\ALTIUM_TOOL\SCHEMATICS_PARTS\MS_DISCRETE_Library.schlib; Footprint Path: Y:\MIS_DATABASE\Library\ALTIUM_TOOL\PCB_FOOTPRINTS\Altium_Footprint_Lib.PcbLib; PCB Footprint: RES0201_0-5
R9 = RESISTOR_Dup2: RES 10K 1/20W 5% 0201; Part Reference: R9; Part_type: RESISTORS\FIXED; Mfr_part_number: RC0201JR-0710KL; Mfr_name: YAGEO AMERICA; Mistral Part No: 110010070051-R; Custom_Duty: 15%; Customs_HS_Code: 85332119; Voltage: NA; Project: GOLDEN-I LITE; Value: 10K; Footprint Path: Y:\MIS_DATABASE\Library\ALTIUM_TOOL\PCB_FOOTPRINTS\Altium_Footprint_Lib.PcbLib; Library Path: Y:\MIS_DATABASE\Library\ALTIUM_TOOL\SCHEMATICS_PARTS\MS_DISCRETE_Library.schlib; MECHANICAL 3D STEP FILE: RES0201_0-5; Chkd/date: MANIRAJA/050517; Crtd /date: MANIRAJA/050517; Datasheet: Y:\MIS_DATABASE\DATASHEETS\RESISTORS\RCXXXXL-SER_MAR18.PDF; Temperature: -55°C+125°C; Weight: 0.17mg; Height: 0.26MM; Library Ref: RESISTOR; Distributor_part_number: 311-10KNCT-ND; Distributor_name: DIGIKEY; Package: 0201; Wattage: 1/20W; Tolerance: 5%; Footprint Ref: RES0201_0-5; PCB Footprint: RES0201_0-5
R14 = RESISTOR_Dup2: RES 10K 1/20W 5% 0201; Part Reference: R14; Mistral Part No: 110010070051-R; Mfr_name: YAGEO AMERICA; Mfr_part_number: RC0201JR-0710KL; Part_type: RESISTORS\FIXED; Project: GOLDEN-I LITE; Voltage: NA; Customs_HS_Code: 85332119; Custom_Duty: 15%; Value: 10K; Footprint Ref: RES0201_0-5; Tolerance: 5%; Wattage: 1/20W; Package: 0201; Distributor_name: DIGIKEY; Distributor_part_number: 311-10KNCT-ND; Library Ref: RESISTOR; Height: 0.26MM; Weight: 0.17mg; Temperature: -55°C+125°C; Datasheet: Y:\MIS_DATABASE\DATASHEETS\RESISTORS\RCXXXXL-SER_MAR18.PDF; Crtd /date: MANIRAJA/050517; Chkd/date: MANIRAJA/050517; MECHANICAL 3D STEP FILE: RES0201_0-5; Library Path: Y:\MIS_DATABASE\Library\ALTIUM_TOOL\SCHEMATICS_PARTS\MS_DISCRETE_Library.schlib; Footprint Path: Y:\MIS_DATABASE\Library\ALTIUM_TOOL\PCB_FOOTPRINTS\Altium_Footprint_Lib.PcbLib; PCB Footprint: RES0201_0-5
R77 = RESISTOR_Dup2: RES 0E 1/4W JUMPER 0406; Part Reference: R77; Mistral Part No: 110021060031-R; Mfr_name: VISHAY; Mfr_part_number: RCL04060000Z0EA; Part_type: RESISTORS\FIXED; Project: TI_J7AEP_EVM; Tolerance: NA; Customs_HS_Code: 85332119; Custom_Duty: 15%; Value: 0E; Footprint Ref: RES0406_0-5; Voltage: NA; Wattage: 1/4W; Distributor_name: DIGIKEY; Distributor_part_number: 541-1915-1-ND; Library Ref: RESISTOR; Height: 0.45MM; Weight: 2mg; Temperature: -55°C+155°C; Datasheet: Y:\MIS_DATABASE\DATASHEETS\RESISTORS\RCL-E3-SER_JUN21.PDF; Crtd /date: MANIRAJA/250621; Chkd/date: ALVY/250621; MECHANICAL 3D STEP FILE: RES0406_0-5; Library Path: Y:\MIS_DATABASE\Library\ALTIUM_TOOL\SCHEMATICS_PARTS\MS_DISCRETE_Library.schlib; Footprint Path: Y:\MIS_DATABASE\Library\ALTIUM_TOOL\PCB_FOOTPRINTS\Altium_Footprint_Lib.PcbLib; PCB Footprint: RES0406_0-5
U1 = TCA6408ARGTR_VQFN16: IC 8-BIT I2C AND SMBUS I/O EXPANDER WITH INTERRUPT O/P VQFN16; Part Reference: U1; Mistral Part No: 141018100011-R; Mfr_name: TEXAS INSTRUMENTS; Part_type: ICS\INTERFACE; Project: TI_60GHz-AOP; Tolerance: NA; Customs_HS_Code: 85423100; Custom_Duty: 15%; Value: TCA6408ARGTR; Footprint Ref: QFN16_19-68_120X120_1_EP1-6; Mfr_part_number: TCA6408ARGTR; Voltage: NA; Wattage: NA; Package: VQFN16; Distributor_name: DIGIKEY; Distributor_part_number: 296-24825-1-ND; Library Ref: TCA6408ARGTR_VQFN16; Height: 1.00MM; Weight: 24.1mg; Temperature: -40°C+85°C; Datasheet: Y:\MIS_DATABASE\DATASHEETS\ICS\INTERFACE\TCA6408AXX.PDF; Crtd /date: MANIRAJA/151018; Chkd/date: MANIRAJA/151018; MECHANICAL 3D STEP FILE: QFN16_19-68_120X120_1_EP1-6; Library Path: Y:\MIS_DATABASE\Library\ALTIUM_TOOL\SCHEMATICS_PARTS\MS_MISCINTERFACE_Library.schlib; Footprint Path: Y:\MIS_DATABASE\Library\ALTIUM_TOOL\PCB_FOOTPRINTS\Altium_Footprint_Lib.PcbLib; PCB Footprint: QFN16_19-68_120X120_1_EP1-6
U10 = TXS0108ERGYR_QFN20: IC TRANSLATOR BIDIRECTIONAL VOLTAGE-LEVEL 8BIT QFN20; Part Reference: U10; Part_type: ICS\INTERFACE; Mfr_name: TEXAS INSTRUMENTS; Mistral Part No: 141011040019-R; Custom_Duty: 15%; Customs_HS_Code: 85423100; Wattage: NA; Project: OMAPL1_PEC20; Value: TXS0108ERGYR; MECHANICAL 3D STEP FILE: QFN20_19-68_185X145_1; Chkd/date: VASANTHA/060117; Crtd /date: BAVISH/280411; Datasheet: Y:\MIS_DATABASE\DATASHEETS\ICS\INTERFACE\TXS0108E.PDF; Temperature: -40°C+85°C; Weight: 43mg; Height: 1.00MM; Library Ref: TXS0108ERGYR_QFN20; Distributor_part_number: 296-24806-1-ND; Distributor_name: DIGIKEY; Package: QFN20; Voltage: NA; Tolerance: NA; Mfr_part_number: TXS0108ERGYR; PCB Footprint: QFN20_19-68_185X145_1
U26 = TXS0108ERGYR_QFN20: IC TRANSLATOR BIDIRECTIONAL VOLTAGE-LEVEL 8BIT QFN20; Part Reference: U26; Mistral Part No: 141011040019-R; Mfr_name: TEXAS INSTRUMENTS; Part_type: ICS\INTERFACE; Project: OMAPL1_PEC20; Tolerance: NA; Customs_HS_Code: 85423100; Custom_Duty: 15%; Value: TXS0108ERGYR; Mfr_part_number: TXS0108ERGYR; Voltage: NA; Wattage: NA; Package: QFN20; Distributor_name: DIGIKEY; Distributor_part_number: 296-24806-1-ND; Library Ref: TXS0108ERGYR_QFN20; Height: 1.00MM; Weight: 43mg; Temperature: -40°C+85°C; Datasheet: Y:\MIS_DATABASE\DATASHEETS\ICS\INTERFACE\TXS0108E.PDF; Crtd /date: BAVISH/280411; Chkd/date: VASANTHA/060117; MECHANICAL 3D STEP FILE: QFN20_19-68_185X145_1; PCB Footprint: QFN20_19-68_185X145_1
U64 = SN74AVC4T245PW_TSSOP16: IC 4-BIT DUAL SUPPLY BUS TRANSCEIVER TSSOP16; Part Reference: U64; Mistral Part No: 141009030111-R; Mfr_name: TEXAS INSTRUMENTS; Part_type: ICS\DIGITAL\COMBINATIONAL; Project: VOCERA; Customs_HS_Code: 85423100; Custom_Duty: 15%; Value: SN74AVC4T245PW; Mfr_part_number: SN74AVC4T245PW; Package: TSSOP16; Distributor_name: MOUSER; Distributor_part_number: 595-SN74AVC4T245PW; Library Ref: SN74AVC4T245PW_TSSOP16; Height: 1.20MM; Datasheet: Y:\MIS_DATABASE\DATASHEETS\ICS\DIGITAL\BUSTRANSCEIVER\SN74AVC4T245.PDF; Crtd /date: MAZHAR/270406; Chkd/date: SHREESHAIL/030506; RoHS: Sb/ Br FREE; PCB Footprint: TSSOP16_25-59_205X180